# Altium project pulse_generator.PrjPcb
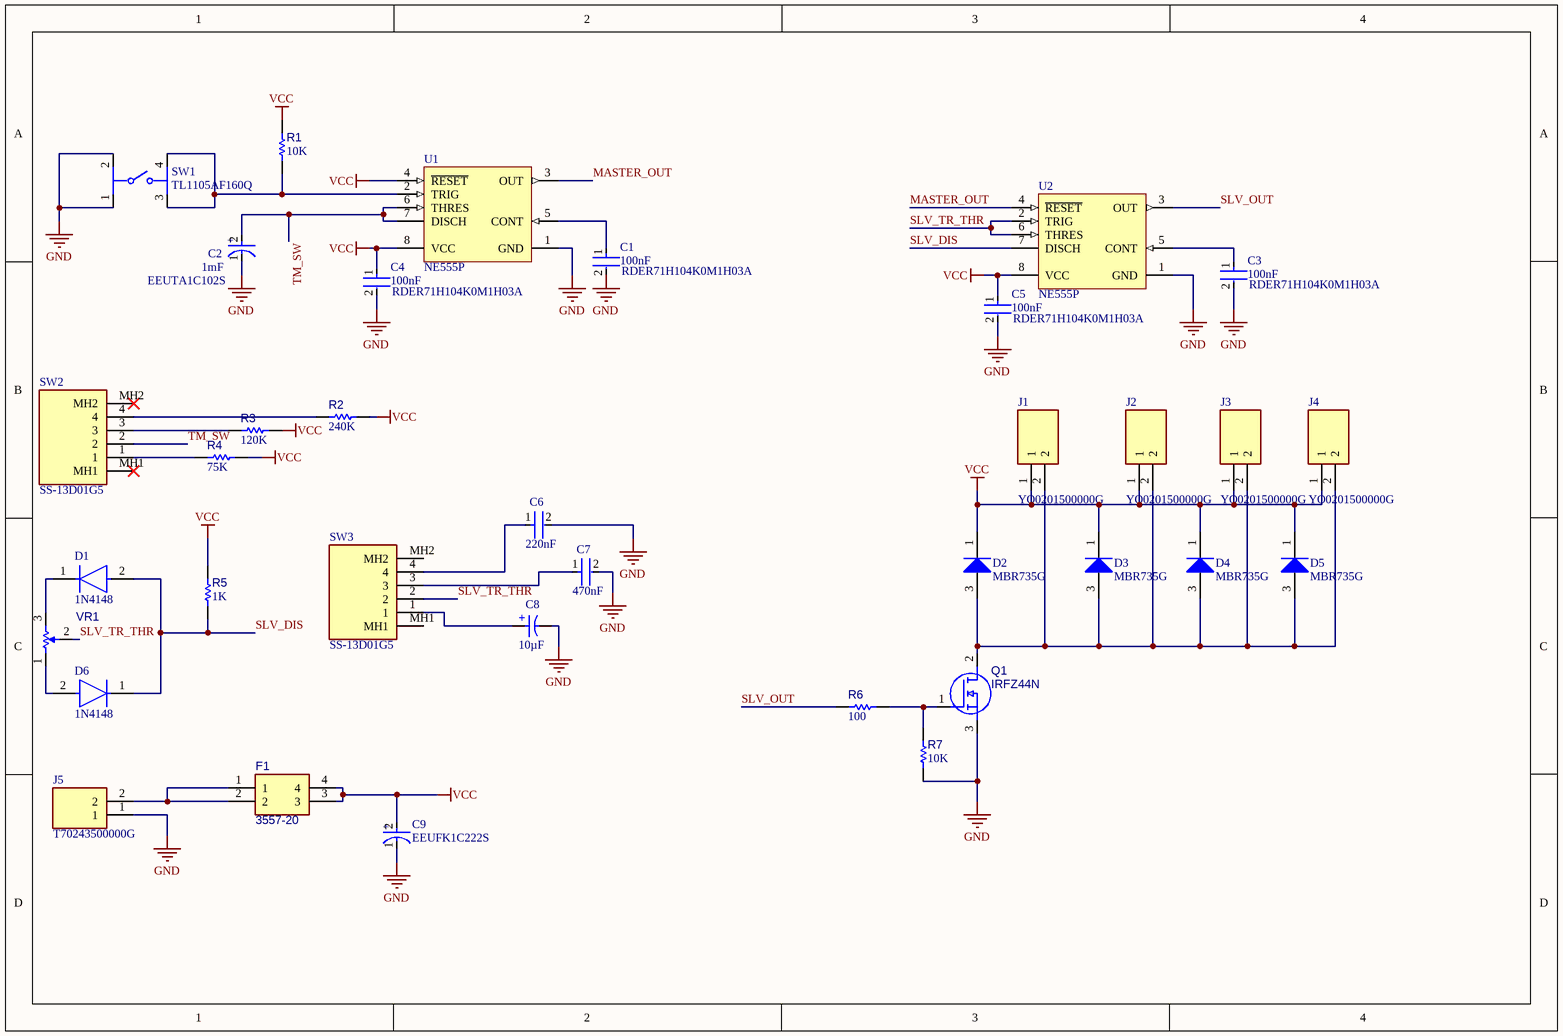
[diagram p0: pulse_generator.SchDoc]
1 sheet, 35 parts. Net scope: global (net labels, ports and power ports of the same name join across sheets).
Board file: pulse_generator.PcbDoc

## Sheet pulse_generator.SchDoc
size A4; SheetNumber: 1; SheetTotal: 1

### Parts
C1  RDER71H104K0M1H03A  Capacitance: 100nF  [FP-RDE0M1-MFG]
C2  EEUTA1C102S  Capacitance: 1mF  [FP-RAD-TH-D_16_0_5-L_15_1-MFG]
C3  RDER71H104K0M1H03A  Capacitance: 100nF  [FP-RDE0M1-MFG]
C4  RDER71H104K0M1H03A  Capacitance: 100nF  [FP-RDE0M1-MFG]
C5  RDER71H104K0M1H03A  Capacitance: 100nF  [FP-RDE0M1-MFG]
C6  Capacitance: 220nF  [FP-RCE1A2-MFG]  (hidden comment: RCER71H224K1DBH03A)
C7  Capacitance: 470nF  [FP-RCE1A2-MFG]  (hidden comment: RCER71H474K1A2H03B)
C8  Capacitance: 10µF  [WCAP-ATG5_D5H11]  (hidden comment: 860020372001)
C9  EEUFK1C222S  [FP-RAD-TH-D_16_0_5-L_15_1-MFG]
D1  1N4148  [FP-017AG-MFG]
D2  MBR735G  [ONSC-TO-220-2-221B-04_E]
D3  MBR735G  [ONSC-TO-220-2-221B-04_E]
D4  MBR735G  [ONSC-TO-220-2-221B-04_E]
D5  MBR735G  [ONSC-TO-220-2-221B-04_E]
D6  1N4148  [FP-017AG-MFG]
F1  3557-20  [3557-20-Footprint-1]
J1  YO0201500000G  [YO0201500000G-Footprint-1]
J2  YO0201500000G  [YO0201500000G-Footprint-1]
J3  YO0201500000G  [YO0201500000G-Footprint-1]
J4  YO0201500000G  [YO0201500000G-Footprint-1]
J5  T70243500000G  [T70243500000G-Footprint-1]
Q1  IRFZ44N  [IRFZ44N-Footprint-1]
R1  value 10K  [Resistor THT 0.4-Footprint-1]  (hidden comment: Resistor THT 0.4)
R2  value 240K  [Resistor THT 0.4-Footprint-1]  (hidden comment: Resistor THT 0.4)
R3  value 120K  [Resistor THT 0.4-Footprint-1]  (hidden comment: Resistor THT 0.4)
R4  value 75K  [Resistor THT 0.4-Footprint-1]  (hidden comment: Resistor THT 0.4)
R5  value 1K  [Resistor THT 0.4-Footprint-1]  (hidden comment: Resistor THT 0.4)
R6  value 100  [Resistor THT 0.4-Footprint-1]  (hidden comment: Resistor THT 0.4)
R7  value 10K  [Resistor THT 0.4-Footprint-1]  (hidden comment: Resistor THT 0.4)
SW1  TL1105AF160Q  [FP-TL1105AF160Q-MFG]
SW2  SS-13D01G5  [SS-13D01G5-Footprint-1]
SW3  SS-13D01G5  [SS-13D01G5-Footprint-1]
U1  NE555P  [P0008A]
U2  NE555P  [P0008A]
VR1  Potentiometer_100k  [New footprint 1]  (value not drawn)

### Nets
GND: C1.2 C2.1(C) C3.2 C4.2 C5.2 C6.2 C7.2 C8.2(N) C9.1(C) J5.1 Q1.3(S) R7.1(A) SW1.1 SW1.2 U1.1(GND) U2.1(GND)
VCC: C4.1 C5.1 C9.2(A) D2.1(K) D3.1(K) D4.1(K) D5.1(K) F1.3 F1.4 J1.1 J2.1 J3.1 J4.1 R1.2(B) R2.1(A) R3.1(A) R4.1(A) R5.2(B) U1.4(~{RESET}) U1.8(VCC) U2.8(VCC)
MASTER_OUT: U1.3(OUT) U2.4(~{RESET})
SLV_DIS: D1.2(A) D6.1(C) R5.1(A) U2.7(DISCH)
SLV_OUT: R6.2(B) U2.3(OUT)
SLV_TR_THR: SW3.2 U2.2(TRIG) U2.6(THRES) VR1.2(TAP)
TM_SW: C2.2(A) SW2.2 U1.6(THRES) U1.7(DISCH)
NetC1_1: C1.1 U1.5(CONT)
NetC3_1: C3.1 U2.5(CONT)
NetC6_1: C6.1 SW3.4
NetC7_1: C7.1 SW3.3
NetC8_1: C8.1(P) SW3.1
NetD1_1: D1.1(C) VR1.3(B)
NetD2_3: D2.3(A) D3.3(A) D4.3(A) D5.3(A) J1.2 J2.2 J3.2 J4.2 Q1.2(D)
NetD6_2: D6.2(A) VR1.1(A)
NetF1_1: F1.1 F1.2 J5.2
NetQ1_1: Q1.1(G) R6.1(A) R7.2(B)
NetR1_1: R1.1(A) SW1.3 SW1.4 U1.2(TRIG)
NetR2_2: R2.2(B) SW2.4
NetR3_2: R3.2(B) SW2.3
NetR4_2: R4.2(B) SW2.1

Not connected (* = marked no-connect by the designer): SW2 MH1* MH2*; SW3 MH1 MH2

### Notes on the sheet
- (in symbol CMP-03913-53914165-2) +
- (in symbol CMP-05427-001148-1) +
- (in symbol CMP-05427-001230-1) +

### Library data of the parts
C1 C3-C5 = CMP-06035-051680-1: Ceramic Capacitor 100nF ±10% 50V X7R Radial; Lead/Base Style: Kinked; Lead Diameter: 0.5mm; Lead Free: Lead Free; Mount: Through Hole; Package Quantity: 2000; Lead Pitch: 0.197inch; Case/Package: Radial; Tolerance: 10%; Height - Seated (Max): 0.236inch; Max Operating Temperature: 125°C; Dielectric: X7R; Min Operating Temperature: -55°C; Voltage Rating (DC): 50V; Voltage Rating: 50V; Termination: Radial; Height: 3.5mm; Resistor Type: Ceramic; Width: 3.5mm; Packaging: Tape and Reel; Length: 0.157inch
C2 = CMP-05427-001230-1: Aluminum Electrolytic Capacitors (Radial Lead Type) AEC-Q200 Qualified 1000uF ±20% 16V; ESR (Equivalent Series Resistance): 47mR; Ripple Current: 1.52A; Life (Hours): 2000Hour; Lead Diameter: 0.8mm; Mount: Through Hole; Packaging: Bulk; Radiation Hardening: No; Series: TA; Length: 15mm; RoHS Compliant: Yes; Tolerance: 20%; Height: 15mm; Voltage Rating (DC): 16V; Voltage Rating: 16V; Max Operating Temperature: 125°C; Diameter: 16mm; Case/Package: Radial; REACH SVHC: No SVHC; Impedance: 47mR; Height - Seated (Max): 0.65inch; Number of Pins: 2; Package Quantity: 100; Termination: Radial; Lead Pitch: 7.5mm; Min Operating Temperature: -40°C
C6 = CMP-06035-041225-1: Cap Ceramic 220nF 50V X7R ±10% Radial 2.5mm +125°C Automotive Ammo Pack; Lead/Base Style: Straight; Lead Diameter: 0.5mm; Height: 3.5mm; Case/Package: Radial; Mount: Through Hole; Package Quantity: 2000; Max Operating Temperature: 125°C; Resistor Type: Ceramic; Length: 0.157inch; Width: 0.098inch; Termination: Radial; Voltage Rating: 50V; Voltage Rating (DC): 50V; Ratings: AEC-Q200; Dielectric: X7R; Min Operating Temperature: -55°C; Tolerance: 10%; Packaging: Tape and Reel; Height - Seated (Max): 0.138inch; Lead Pitch: 0.098inch
C7 = CMP-06035-009921-1: Cap Ceramic 470nF 50V X7R ±10% Radial 2.5mm +125°C Automotive Bulk; Lead Diameter: 0.5mm; Lead/Base Style: Straight; Length: 0.157inch; Tolerance: 10%; Ratings: AEC-Q200; Case/Package: Radial; Termination: Radial; Resistor Type: Ceramic; Lead Pitch: 0.098inch; Min Operating Temperature: -55°C; Voltage Rating (DC): 50V; Width: 0.098inch; Height - Seated (Max): 0.138inch; Height: 3.5mm; Voltage Rating: 50V; Packaging: Bulk; Mount: Through Hole; Max Operating Temperature: 125°C; Dielectric: X7R; Package Quantity: 500
C8 = CMP-03913-53914165-2: WCAP-ATG5 Aluminum Electrolytic Capacitors; Voltage Rating (DC): 16V; Pitch: 2mm; Tolerance: 20%; Polarity: Polar; Leakage Current: 3µA; Material: Aluminium; Life (Hours): 2000hours; Ripple Current: 35mA; Diameter: 5mm; Length: 11mm; Height - Seated (Max): 12.4968mm; Lead Pitch: 2.0066mm; Mount: Through Hole; Max Operating Temperature: 105°C; REACH SVHC: Unknown; Case/Package: Radial; Height: 11mm; Packaging: Tape & Box (TB); RoHS: Compliant; Min Operating Temperature: -40°C; Voltage Rating: 16V
C9 = CMP-05427-001148-1: Aluminum Electrolytic Capacitors (Radial Lead Type) AEC-Q200 Qualified 2200uF ±20% 16V; Capacitance: 2.2mF; Impedance: 38mR; Ripple Current: 1.8A; Life (Hours): 5000Hour; Lead Diameter: 0.8mm; Dielectric Material: Aluminium; Voltage: 16V; Case/Package: Radial; Tolerance: 20%; Series: FK Radial; Voltage Rating (DC): 16V; Voltage Rating: 16V; RoHS Compliant: Yes; Diameter: 16mm; Number of Pins: 2; Radiation Hardening: No; Max Operating Temperature: 105°C; Packaging: Bulk; Lead Pitch: 7.5mm; Min Operating Temperature: -55°C; Construction: RADIAL; Height: 15mm; REACH SVHC: No SVHC; Termination: Radial; Mount: Through Hole
D1 D6 = CMP-07163-000046-1: DIODE GEN PURP 100V 200MA DO35; Forward Voltage: 1V; Max Power Dissipation: 500mW; Max Reverse Current: 5uA; Forward Current: 300mA; Current: 4A; Reverse Recovery Time: 4ns; Element Configuration: Single; Outside Diameter: 1.85mm; Capacitance: 4pF; Polarity: Standard; Max Forward Surge Current (Ifsm): 1A; Reverse Voltage: 100V; Output Current: 200mA; Average Rectified Current: 200mA; Diameter: 1.91mm; Max Repetitive Reverse Voltage (Vrrm): 100V; Current Rating: 200mA; Case/Package: DO-35; Lead Free: Lead Free; Number of Pins: 2; Recovery Time: 4ns; Packaging: Bulk; Contact Plating: Tin; Voltage: 100V; Mount: Through Hole; Max Surge Current: 4A; Package Quantity: 2000; Width: 1.91mm; Max Reverse Voltage (DC): 100V; Length: 4.56mm; Radiation Hardening: No; Power Dissipation: 500mW; Voltage Rating (DC): 100V; Peak Non-Repetitive Surge Current: 4A; REACH SVHC: No SVHC; Height: 4.56mm; Max Operating Temperature: 175°C; Series: -; Weight: 0.01lb; Min Operating Temperature: -65°C
D2-D5 = CMP-1055-00596-1: SWITCHMODE(TM) Power Rectifier, 2-Pin TO-220, Pb-Free, Tube; Manufacturer: On Semiconductor; IFSM Max (A): 150; Configuration: Single; ComponentLink1Description: Manufacturer URL; RoHS: TRUE; ComponentLink1URL: http://www.onsemi.com/; Packing: Tube; PackageReference: TO-220-2-221B-04_E; DatasheetVersion: Rev. 8; PartNumber: MBR735G; ComponentLink2Description: Datasheet; ComponentLink2URL: http://www.onsemi.cn/pub_link/Collateral/MBR735-D.PDF; ComponentLink3URL: http://www.onsemi.com/pub_link/Collateral/BYW29-D.PDF; Mounting Technology: Through Hole; PackageVersion: Rev. E; PackageDescription: 2-Pin Flange Mount, Vertical Straight Lead, Body 9.97 x 4.44 mm, Pitch 5.08 mm; ComponentLink3Description: Package Specification
F1 = CMP-005-00013-1: Fuse Holder T/H 2 IN 1 AUTO BLDE HOLDER, YELLOW 20A
J1-J4 = CMP-002-00073-1: Conn Terminal Block 2 POS 3.5mm Solder ST Thru-Hole 10A/Contact Box; Voltage Rating: 300V; Pins: 2
J5 = CMP-002-00072-1: Terminal Block 2P; Voltage Rating: 300V; Max Operating Temperature: 115°C; Pins: 2; Min Operating Temperature: -40°C
Q1 = CMP-004-00031-1: N-Channel MOSFET Transistor
R1-R7 = CMP-009-00181-2: Resistor THT axial 0.4
SW1 = CMP-17879-000016-1: SWITCH TACTILE SPST-NO 0.05A 12V; Mechanical Life: 100000Cycles; Contact Current Rating: 50mA; Contact Resistance: 100mR; Switch Function: Off-Mom; Actuator Type: Standard; Actuator Length: 1.4mm; Max Voltage Rating (DC): 50V; Throw Configuration: SPST; Actuator Material: Nylon; Illumination Type: Non-Illuminated; Switch Travel: 0.25mm; Operating Force: 160gf; Package Quantity: 750; Width: 6mm; Series: TL1105; Voltage Rating (DC): 12V; Length: 6mm; Contact Plating: Silver; Color: Black; Housing Material: Nylon; Min Operating Temperature: -20°C; Lead Free: Lead Free; Mount: Through Hole; Termination: PC Pin; RoHS Compliant: Yes; Orientation: Straight; Max Operating Temperature: 70°C; Reach SVHC Compliant: Yes; Packaging: Bulk; Electrical Life: 100000Cycles; Current Rating: 50mA; Contact Material: Bronze; Size: 6mm
SW2 SW3 = CMP-002-00071-3: Switch Slide 3 Position SP3T; Number of Positions: 3; Mounting Technology: THT
U1 U2 = CMP-2000-04954-1: Precision Timer, 4.5 to 16 V, 0 to 70 degC, 8-Pin DIP, Pb-Free, Tube; Manufacturer: TexasInstruments; Maximum High Level Output Current: -200mA; Number of Internal Timers: 1; Operating Supply Voltage: 5; Maximum Low Level Output Current: 200mA; Rad Hard: No; Packaging: Rail/Tube; Manufacturer URL: http://www.ti.com/; Package Reference: P8; Package Description: 8-Pin Double In-line Package, Body 9.59 x 6.35 mm, Pitch 2.54 mm; Package URL: http://www.ti.com/lit/ml/mpdi001b/mpdi001b.pdf; Type: Standard; Datasheet URL: http://www.ti.com/general/docs/lit/getliterature.tsp?genericPartNumber=NE555&fileType=pdf; Category: Timer; Package: 8PDIP; Datasheet Version: Rev. I, 09/2014
VR1 = CMP-009-00179-1: Potencjometr osiowy 100k liniowy PCB